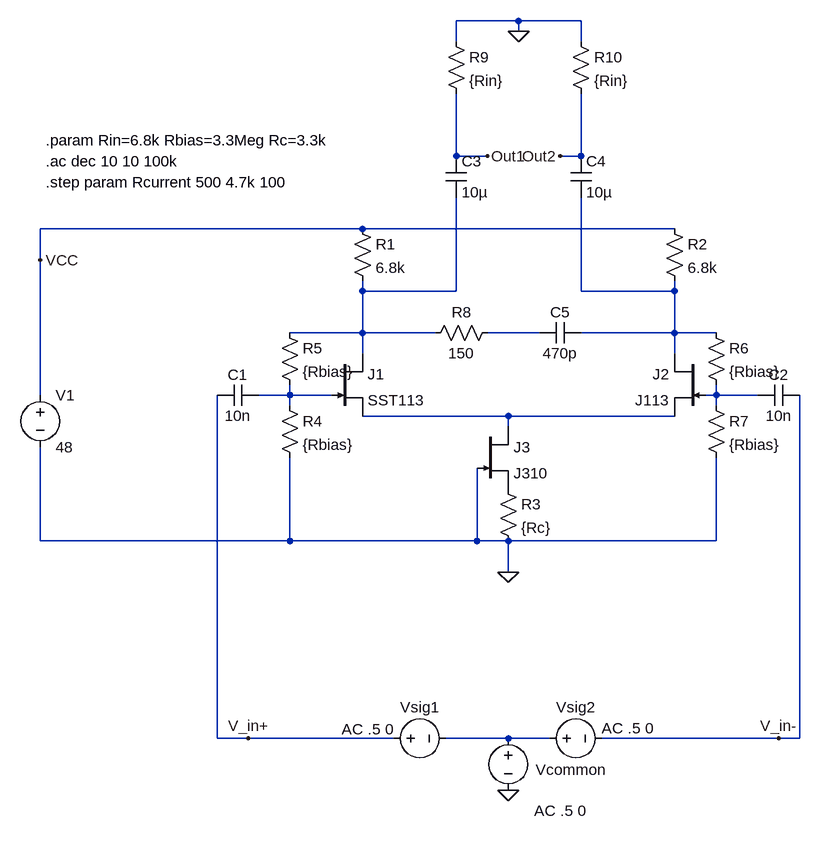
[diagram p0: schematic Preamp_HiGain.asc]
Preamp_HiGain.asc, the LTspice schematic file:
Version 4
SHEET 1 1864 1088
WIRE 560 -144 464 -144
WIRE 656 -144 560 -144
WIRE 560 -128 560 -144
WIRE 464 -112 464 -144
WIRE 656 -112 656 -144
WIRE 464 64 464 -32
WIRE 512 64 464 64
WIRE 656 64 656 -32
WIRE 656 64 624 64
WIRE 320 176 -176 176
WIRE 800 176 320 176
WIRE -176 224 -176 176
WIRE 320 272 320 256
WIRE 464 272 464 128
WIRE 464 272 320 272
WIRE 656 272 656 128
WIRE 800 272 800 256
WIRE 800 272 656 272
WIRE 320 336 320 272
WIRE 320 336 208 336
WIRE 432 336 320 336
WIRE 592 336 512 336
WIRE 800 336 800 272
WIRE 800 336 656 336
WIRE 864 336 800 336
WIRE 320 368 320 336
WIRE 800 368 800 336
WIRE -176 432 -176 224
WIRE 208 432 208 416
WIRE 208 432 160 432
WIRE 272 432 208 432
WIRE 864 432 864 416
WIRE 864 432 848 432
WIRE 928 432 864 432
WIRE 208 448 208 432
WIRE 864 448 864 432
WIRE 544 464 320 464
WIRE 800 464 544 464
WIRE 544 480 544 464
WIRE -176 656 -176 512
WIRE 208 656 208 528
WIRE 208 656 -176 656
WIRE 496 656 496 544
WIRE 496 656 208 656
WIRE 544 656 496 656
WIRE 864 656 864 528
WIRE 864 656 544 656
WIRE 544 704 544 656
WIRE 96 960 96 432
WIRE 144 960 96 960
WIRE 368 960 144 960
WIRE 544 960 448 960
WIRE 608 960 544 960
WIRE 960 960 688 960
WIRE 992 960 992 432
WIRE 992 960 960 960
FLAG 544 704 0
FLAG -176 224 VCC
FLAG 512 64 Out1
FLAG 624 64 Out2
FLAG 560 -128 0
FLAG 960 960 V_in-
FLAG 144 960 V_in+
FLAG 544 1040 0
SYMBOL njf 272 368 R0
SYMATTR InstName J1
SYMATTR Value SST113
SYMBOL njf 848 368 M0
SYMATTR InstName J2
SYMATTR Value J113
SYMBOL res 304 160 R0
SYMATTR InstName R1
SYMATTR Value 6.8k
SYMBOL res 784 160 R0
SYMATTR InstName R2
SYMATTR Value 6.8k
SYMBOL res 528 560 R0
SYMATTR InstName R3
SYMATTR Value {Rc}
SYMBOL res 192 432 R0
SYMATTR InstName R4
SYMATTR Value {Rbias}
SYMBOL res 192 320 R0
SYMATTR InstName R5
SYMATTR Value {Rbias}
SYMBOL res 848 320 R0
SYMATTR InstName R6
SYMATTR Value {Rbias}
SYMBOL res 848 432 R0
SYMATTR InstName R7
SYMATTR Value {Rbias}
SYMBOL cap 160 416 R90
WINDOW 0 0 32 VBottom 2
WINDOW 3 32 32 VTop 2
SYMATTR InstName C1
SYMATTR Value 10n
SYMATTR SpiceLine Rser=882.6m Lser=318.58p
SYMBOL cap 992 416 R90
WINDOW 0 0 32 VBottom 2
WINDOW 3 32 32 VTop 2
SYMATTR InstName C2
SYMATTR Value 10n
SYMATTR SpiceLine Rser=786.2m Lser=151.38p
SYMBOL cap 448 64 R0
SYMATTR InstName C3
SYMATTR Value 10µ
SYMATTR SpiceLine Rser=27.8m Lser=187.57p
SYMBOL cap 640 64 R0
SYMATTR InstName C4
SYMATTR Value 10µ
SYMATTR SpiceLine Rser=16.5m Lser=200.49p
SYMBOL voltage -176 416 R0
SYMATTR InstName V1
SYMATTR Value 48
SYMATTR SpiceLine Rser=0
SYMBOL voltage 352 960 R270
WINDOW 0 32 56 VTop 2
WINDOW 3 -32 56 VBottom 2
WINDOW 123 30 -24 VBottom 2
SYMATTR InstName Vsig1
SYMATTR Value ""
SYMATTR Value2 AC .5 0
SYMATTR SpiceLine Rser=0
SYMBOL njf 496 480 R0
SYMATTR InstName J3
SYMATTR Value J310
SYMBOL res 448 -128 R0
SYMATTR InstName R9
SYMATTR Value {Rin}
SYMBOL res 640 -128 R0
SYMATTR InstName R10
SYMATTR Value {Rin}
SYMBOL res 528 320 R90
WINDOW 0 0 56 VBottom 2
WINDOW 3 32 56 VTop 2
SYMATTR InstName R8
SYMATTR Value 150
SYMBOL cap 656 320 R90
WINDOW 0 0 32 VBottom 2
WINDOW 3 32 32 VTop 2
SYMATTR InstName C5
SYMATTR Value 470p
SYMATTR SpiceLine Rser=16.5m Lser=200.49p
SYMBOL voltage 592 960 R270
WINDOW 0 32 56 VTop 2
WINDOW 3 -32 56 VBottom 2
WINDOW 123 31 136 VBottom 2
SYMATTR InstName Vsig2
SYMATTR Value ""
SYMATTR Value2 AC .5 0
SYMATTR SpiceLine Rser=0
SYMBOL voltage 544 944 R0
WINDOW 0 42 64 Left 2
WINDOW 3 40 99 Left 2
WINDOW 123 40 127 Left 2
WINDOW 39 0 0 Left 0
SYMATTR InstName Vcommon
SYMATTR Value ""
SYMATTR Value2 AC .5 0
TEXT -168 72 Left 2 !.ac dec 10 10 100k
TEXT -168 40 Left 2 !.param Rin=6.8k Rbias=3.3Meg Rc=3.3k
TEXT -168 104 Left 2 !.step param Rcurrent 500 4.7k 100

The netlist it stands for:
* Preamp_HiGain.asc
J1 N001 N004 N006 SST113
J2 N002 N005 N006 J113
R1 VCC N001 6.8k
R2 VCC N002 6.8k
R3 P001 0 {Rc}
R4 N004 0 {Rbias}
R5 N001 N004 {Rbias}
R6 N002 N005 {Rbias}
R7 N005 0 {Rbias}
C1 N004 V_in+ 10n Rser=882.6m Lser=318.58p
C2 V_in- N005 10n Rser=786.2m Lser=151.38p
C3 Out1 N001 10µ Rser=27.8m Lser=187.57p
C4 Out2 N002 10µ Rser=16.5m Lser=200.49p
V1 VCC 0 48 Rser=0
Vsig1 V_in+ N007 AC .5 0 Rser=0
J3 N006 0 P001 J310
R9 0 Out1 {Rin}
R10 0 Out2 {Rin}
R8 N003 N001 150
C5 N002 N003 470p Rser=16.5m Lser=200.49p
Vsig2 N007 V_in- AC .5 0 Rser=0
Vcommon N007 0 AC .5 0
.model NJF NJF
.model PJF PJF
.lib standard.jft
.ac dec 10 10 100k
.param Rin=6.8k Rbias=3.3Meg Rc=3.3k
.step param Rcurrent 500 4.7k 100
.backanno
.end